# Altium schematic sheet Encoders.SchDoc
size A4; SheetNumber: 4; SheetTotal: 8
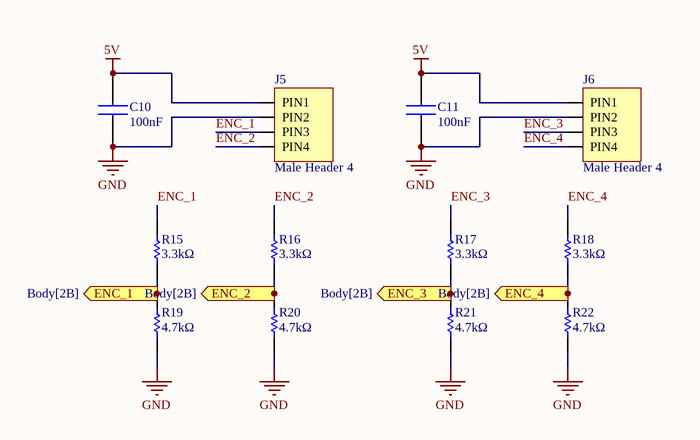
[diagram p0: Encoders.SchDoc]

## Parts
C10  value 100nF  [CAP0805]  (hidden comment: CC0805KRX7R9BB104)
C11  value 100nF  [CAP0805]  (hidden comment: CC0805KRX7R9BB104)
J5  Male Header 4  [MALE HEADER 4]
J6  Male Header 4  [MALE HEADER 4]
R15  value 3.3kΩ  [RES0805]  (hidden comment: 0805W8F3301T5E)
R16  value 3.3kΩ  [RES0805]  (hidden comment: 0805W8F3301T5E)
R17  value 3.3kΩ  [RES0805]  (hidden comment: 0805W8F3301T5E)
R18  value 3.3kΩ  [RES0805]  (hidden comment: 0805W8F3301T5E)
R19  value 4.7kΩ  [RES0805]  (hidden comment: 0805W8F4701T5E)
R20  value 4.7kΩ  [RES0805]  (hidden comment: 0805W8F4701T5E)
R21  value 4.7kΩ  [RES0805]  (hidden comment: 0805W8F4701T5E)
R22  value 4.7kΩ  [RES0805]  (hidden comment: 0805W8F4701T5E)

## Ports
ENC_1 (out, see Body[2B]), ENC_2 (out, see Body[2B]), ENC_3 (out, see Body[2B]), ENC_4 (out, see Body[2B])

## Nets
5V: C10.1 C11.1 J5.PIN1 J6.PIN1
GND: C10.2 C11.2 J5.PIN2 J6.PIN2 R19.1 R20.1 R21.1 R22.1
ENC_1: J5.PIN3 R15.2
ENC_1: R15.1 R19.2 ; port ENC_1  [a separate net that carries the same name]
ENC_2: J5.PIN4 R16.2
ENC_2: R16.1 R20.2 ; port ENC_2  [a separate net that carries the same name]
ENC_3: J6.PIN3 R17.2
ENC_3: R17.1 R21.2 ; port ENC_3  [a separate net that carries the same name]
ENC_4: J6.PIN4 R18.2
ENC_4: R18.1 R22.2 ; port ENC_4  [a separate net that carries the same name]

## Library data of the parts
C10 C11 = CC0805KRX7R9BB104: Multilayer Ceramic Capacitors MLCC - SMD/SMT 50 V 0.1uF X7R 0805 10%; Manufacturer_Name: YAGEO; Geometry.Height: 0.95mm; Manufacturer_Part_Number: CC0805KRX7R9BB104; Datasheet Link: https://www.yageo.com/upload/media/product/productsearch/datasheet/mlcc/UPY-GPHC_X7R_6.3V-to-50V_20.pdf; LCSC: C49678
J5 J6 = Male Header 4: Number of Contacts: 4; Library Ref: Header
R15-R18 = 0805W8F3301T5E: 125mW Thick Film Resistors 150V ±100ppm/℃ ±1% 3.3kΩ 0805 Chip Resistor - Surface Mount ROHS; Manufacturer_Name: UNI-ROYAL; Geometry.Height: 0.95mm; Manufacturer_Part_Number: 0805W8F3301T5E; Datasheet Link: https://wmsc.lcsc.com/wmsc/upload/file/pdf/v2/lcsc/2206010045_UNI-ROYAL-Uniroyal-Elec-0805W8F3301T5E_C26010.pdf; LCSC: C26010
R19-R22 = 0805W8F4701T5E: 125mW Thick Film Resistors 150V ±100ppm/℃ ±1% 4.7kΩ 0805 Chip Resistor - Surface Mount ROHS; Manufacturer_Name: UNI-ROYAL; Geometry.Height: 0.95mm; Manufacturer_Part_Number: 0805W8F4701T5E; Datasheet Link: https://wmsc.lcsc.com/wmsc/upload/file/pdf/v2/lcsc/2206010200_UNI-ROYAL-Uniroyal-Elec-0805W8F4701T5E_C17673.pdf; LCSC: C17673